# Altium schematic sheet 2.5V.SchDoc
size A; SheetNumber: 3; SheetTotal: 4
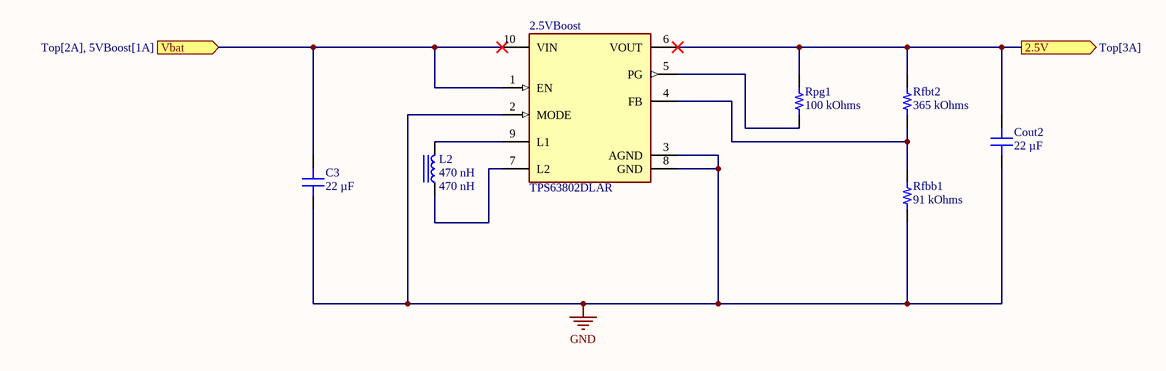
[diagram p0: 2.5V.SchDoc]

## Parts
2.5VBoost  TPS63802DLAR  [FP-DLA0010A-MFG]
C3  value 22 µF  [CAP 0603_1608]  (hidden comment: CL10A226MPCNUBE)
Cout2  value 22 µF  [CAP 0603_1608]  (hidden comment: CL10A226MPCNUBE)
L2  value 470 nH  [BOURNS SRP5030T]  (hidden comment: SRP5030T-R47M)
Rfbb1  value 91 kOhms  [RES 0603_1608]  (hidden comment: ERJ-PA3F9102V)
Rfbt2  value 365 kOhms  [RES 0603_1608]  (hidden comment: RC0603FR-07365KL)
Rpg1  value 100 kOhms  [RES 0603_1608]  (hidden comment: RK73B1JTTD104J)

## Ports
2.5V (out, see Top[3A]), Vbat (in, see Top[2A], 5VBoost[1A])

## Nets
GND: 2.5VBoost.2(MODE) 2.5VBoost.3(AGND) 2.5VBoost.8(GND) C3.1 Cout2.1 Rfbb1.1
2.5V: 2.5VBoost.6(VOUT) Cout2.2 Rfbt2.2 Rpg1.2 ; port 2.5V
Vbat: 2.5VBoost.1(EN) 2.5VBoost.10(VIN) C3.2 ; port Vbat
Net2.5VBoost_4: 2.5VBoost.4(FB) Rfbb1.2 Rfbt2.1
Net2.5VBoost_5: 2.5VBoost.5(PG) Rpg1.1
Net2.5VBoost_7: 2.5VBoost.7(L2) L2.1
Net2.5VBoost_9: 2.5VBoost.9(L1) L2.2

## Library data of the parts
2.5VBoost = CMP-04918-000005-1: IC POWER MANAGEMENT; Manufacturer: Texas Instruments; Nominal Supply Current: 11uA; Max Junction Temp: +125°C; Max Supply Voltage: 5.5V; Switching Topology: Buck-Boost; Min Supply Voltage: 1.3V; Output Current: 2A; Output Voltage: 1.8-5.2V; Number Of Outputs: 1; Switching Frequency: 1.4/1.6/2.1MHz; Description: 2-A, High-efficient, Low IQ Buck-boost Converter in DFN Package; Standoff Height: 0mm; Max Duty Cycle: 100%; Output Type: AdjustableProgrammable; Manufacturer Part Number: TPS63802DLAR; ComponentLink2URL: https://www.ti.com/lit/ds/symlink/tps63802.pdf; Digikey Description: IC POWER MANAGEMENT; Octopart: https://octopart.com/tps63802dlar-texas+instruments-97359678; Height: 1mm; Temperature: -40°C to +125°C; Device Class L3: Voltage Regulators - Switching; Lead Free: Yes; Category: IC; Mouser Description: 2-A, high-efficient, 11-µA quiescent current buck-boost converter in QFN/DFN package 10-VSON-HR -40 to 125; ComponentLink2Description: Datasheet; Temperature Range Low: -40°C; Temperature Range High: +125°C; Automotive: No; Device Class L2: Power Management ICs; RoHS: TRUE; Device Class L1: Integrated Circuits (ICs); Package: DLA0010A
C3 Cout2 = CMP-184-000455-1: CAP CER 22UF 10V X5R 0603; manufacturer: Samsung Electro-Mechanics; Tolerance: ±20%; series: CL; Applications: General Purpose; Operating Temperature: -55°C ~ 85°C; Mounting Type: Surface Mount, MLCC; Thickness (Max): 0.037" (0.95mm); ComponentLink2Description: DigiKey Link; Lifecycle Status: Active; Size / Dimension: 0.063" L x 0.031" W (1.60mm x 0.80mm); partid: 3985; lastupdated: 9/19/2022 1:01:15 PM; Device Package: 0603 (1608 Metric); ComponentLink2URL: https://www.digikey.com/en/products/detail/samsung-electro-mechanics/CL10A226MPCNUBE/5960988; Temperature Coefficient: X5R; Package / Case: 0603 (1608 Metric); price: 0.06; Part Status: Active; Part Number: CL10A226MPCNUBE; Capacitance: 22 µF; packaging: TapeAndReel; Minimum Order: 1; Voltage - Rated: 10V; ComponentLink1Description: Datasheet; ComponentLink1URL: http://www.samsungsem.com/kr/support/product-search/mlcc/CL10A226MPCNUBE.jsp
L2 = CMP-236-000004-1: FIXED IND 470NH 12A 7.4 MOHM SMD; Manufacturer: Bourns Inc.; DC Resistance (DCR): 7.4mOhm Max; Inductance Frequency - Test: 100 kHz; Type: Drum Core, Wirewound; Material - Core: Iron Powder; Tolerance: ±20%; Current - Saturation: 16A; Shielding: Shielded; PartId: 5; ComponentLink2Description: DigiKey Link; ComponentLink2URL: https://www.digikey.com/en/products/detail/bourns-inc/SRP5030T-R47M/3986077; Series: SRP5030T; Minimum Order: 1; Part Status: Active; Current Rating (Amps): 12 A; Size / Dimension: 0.224" L x 0.205" W (5.70mm x 5.20mm); ComponentLink1Description: Datasheet; Price: 0.63; Device Package: Nonstandard; Inductance: 470 nH; Height - Seated (Max): 0.118" (3.00mm); ComponentLink1URL: https://www.bourns.com/docs/Product-Datasheets/SRP5030T.pdf; LastUpdated: 9/19/2022 1:52:24 PM; Packaging: TapeAndReel; Lifecycle Status: Active; Package / Case: Nonstandard; Mounting Type: Surface Mount; Part Number: SRP5030T-R47M; Operating Temperature: -40°C ~ 125°C
Rfbb1 = CMP-289-001040-1: RES SMD 91K OHM 1% 1/4W 0603; Manufacturer: Panasonic Electronic Components; Power (Watts): 0.25W, 1/4W; Temperature Coefficient: ±100ppm/°C; Minimum Order: 1; Number of Terminations: 2; ComponentLink1Description: Datasheet; Resistance: 91 kOhms; Series: ERJ-PA3; ComponentLink1URL: https://industrial.panasonic.com/cdbs/www-data/pdf/RDO0000/AOA0000C331.pdf; Part Status: Active; Price: 0.02; ComponentLink2Description: DigiKey Link; Lifecycle Status: Active; Operating Temperature: -55°C ~ 155°C; Ratings: AEC-Q200; LastUpdated: 9/19/2022 1:22:26 PM; Features: Automotive AEC-Q200, Pulse Withstanding; Tolerance: ±1%; PartId: 7007; Size / Dimension: 0.063" L x 0.031" W (1.60mm x 0.80mm); Supplier Device Package: 0603; ComponentLink2URL: https://www.digikey.com/en/products/detail/panasonic-electronic-components/ERJ-PA3F9102V/5035965; Package / Case: 0603 (1608 Metric); Device Package: 0603 (1608 Metric); Packaging: TapeAndReel; Height - Seated (Max): 0.022" (0.55mm); Part Number: ERJ-PA3F9102V; Composition: Thick Film
Rfbt2 = CMP-289-001331-1: RES 365K OHM 1% 1/10W 0603; Manufacturer: Yageo; Temperature Coefficient: ±100ppm/°C; Power (Watts): 0.1W, 1/10W; Size / Dimension: 0.063" L x 0.031" W (1.60mm x 0.80mm); Tolerance: ±1%; ComponentLink1URL: https://www.yageo.com/upload/media/product/productsearch/datasheet/rchip/PYu-RC_Group_51_RoHS_L_10.pdf; Number of Terminations: 2; Series: RC_L; PartId: 7601; Operating Temperature: -55°C ~ 155°C; Resistance: 365 kOhms; Device Package: 0603 (1608 Metric); Part Number: RC0603FR-07365KL; Packaging: CutTape; Package / Case: 0603 (1608 Metric); ComponentLink2Description: DigiKey Link; Composition: Thick Film; Supplier Device Package: 0603; LastUpdated: 9/19/2022 1:22:24 PM; ComponentLink2URL: https://www.digikey.com/en/products/detail/yageo/RC0603FR-07365KL/727185; Lifecycle Status: Active; Height - Seated (Max): 0.022" (0.55mm); ComponentLink1Description: Datasheet; Part Status: Active; Features: Moisture Resistant; Price: 0.01; Minimum Order: 1
Rpg1 = CMP-289-000475-1: RES 100K OHM 5% 1/10W 0603; Manufacturer: KOA Speer Electronics, Inc.; Temperature Coefficient: ±200ppm/°C; Power (Watts): 0.1W, 1/10W; Ratings: AEC-Q200; Series: RK73B; Size / Dimension: 0.063" L x 0.031" W (1.60mm x 0.80mm); Features: Automotive AEC-Q200; ComponentLink2Description: DigiKey Link; Composition: Thick Film; Resistance: 100 kOhms; Tolerance: ±5%; Height - Seated (Max): 0.022" (0.55mm); Minimum Order: 1; ComponentLink1Description: Datasheet; Operating Temperature: -55°C ~ 155°C; Part Number: RK73B1JTTD104J; Supplier Device Package: 0603; Packaging: CutTape; ComponentLink1URL: http://www.koaspeer.com/catimages/Products/RK73B/RK73B.pdf; Part Status: Active; Number of Terminations: 2; LastUpdated: 9/19/2022 1:22:31 PM; Package / Case: 0603 (1608 Metric); Device Package: 0603 (1608 Metric); Price: 0.01; ComponentLink2URL: https://www.digikey.com/en/products/detail/koa-speer-electronics-inc/RK73B1JTTD104J/9844700; Lifecycle Status: Active; PartId: 5870